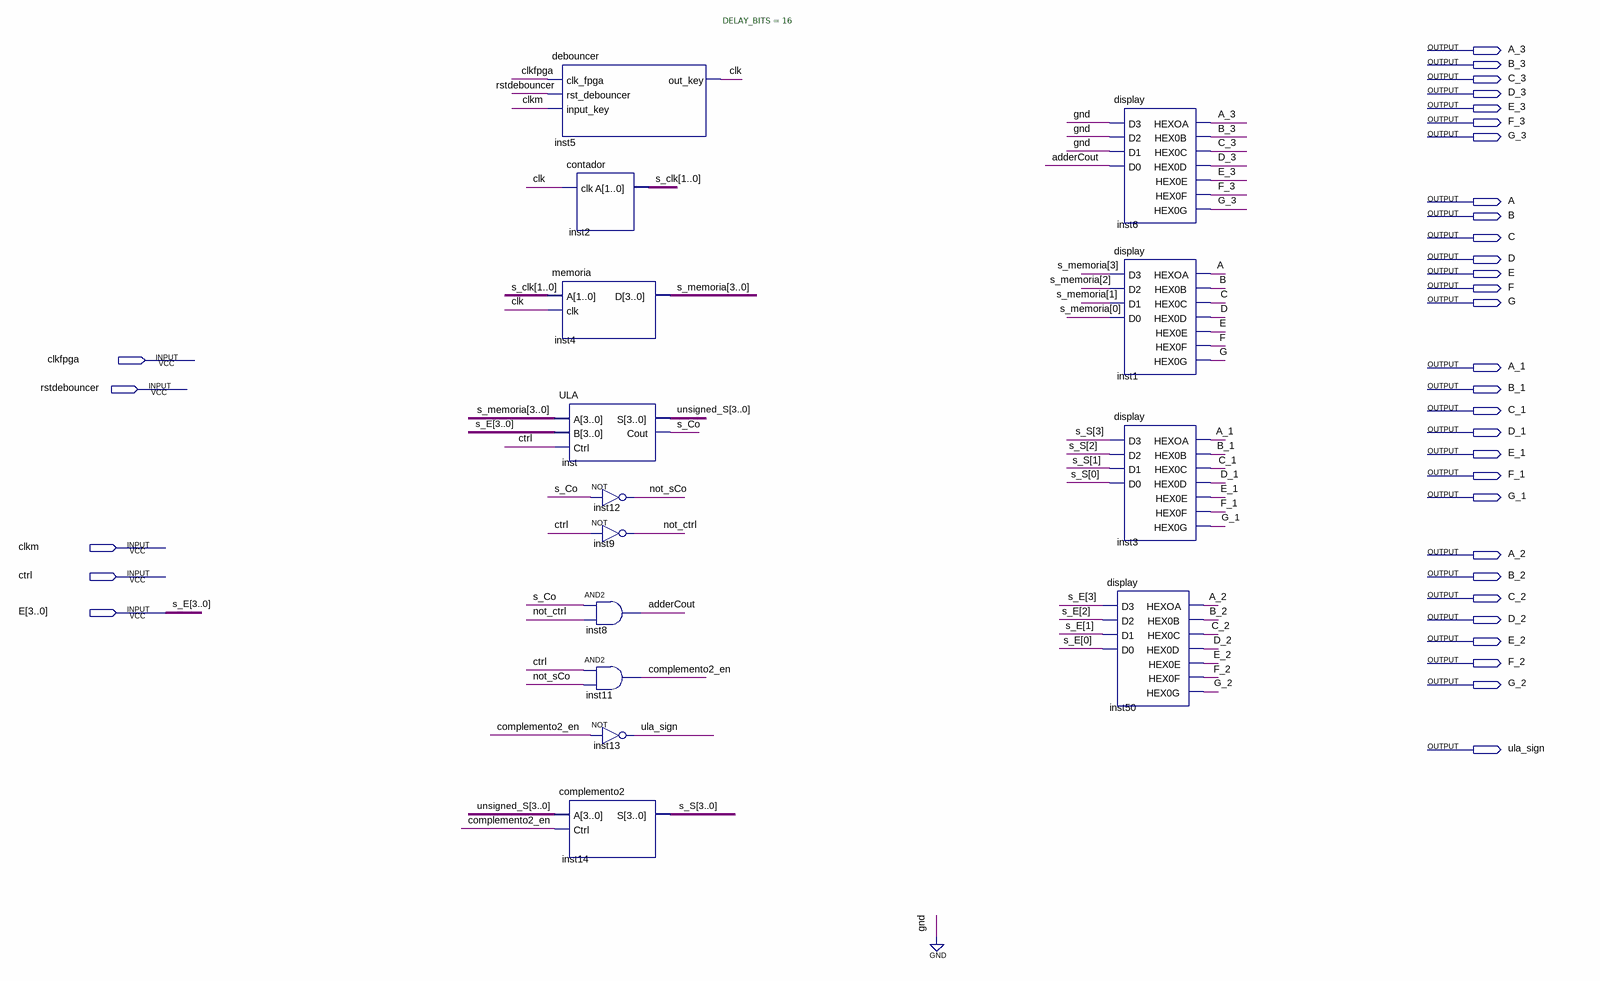
[diagram p0: schematic sheet]
// Quartus schematic calculadora.bdf as structural Verilog: 14 symbols, 34 pins
module calculadora (
  input  clkfpga,
  input  rstdebouncer,
  input  clkm,
  input  ctrl,
  input  [3:0] E,
  output A_3,
  output B_3,
  output C_3,
  output D_3,
  output E_3,
  output F_3,
  output G_3,
  output A,
  output B,
  output C,
  output D,
  output E_1bit,
  output F,
  output G,
  output A_1,
  output B_1,
  output C_1,
  output D_1,
  output E_1,
  output F_1,
  output G_1,
  output A_2,
  output B_2,
  output C_2,
  output D_2,
  output E_2,
  output F_2,
  output G_2,
  output ula_sign
);

  wire adderCout, clk, complemento2_en, not_ctrl, not_sCo, s_Co;
  wire [1:0] s_clk;
  wire [3:0] s_memoria, s_S, unsigned_S;

  debouncer #(.DELAY_BITS(16)) inst5 (
    .clk_fpga(clkfpga), .rst_debouncer(rstdebouncer), .input_key(clkm), .out_key(clk));
  memoria inst4 (.A(s_clk), .clk(clk), .D(s_memoria));
  ULA inst (.A(s_memoria), .B(E), .Ctrl(ctrl), .S(unsigned_S), .Cout(s_Co));
  complemento2 inst14 (.A(unsigned_S), .Ctrl(complemento2_en), .S(s_S));
  contador inst2 (.clk(clk), .A(s_clk));
  not inst12 (not_sCo, s_Co);
  not inst9 (not_ctrl, ctrl);
  and inst8 (adderCout, s_Co, not_ctrl);
  and inst11 (complemento2_en, ctrl, not_sCo);
  not inst13 (ula_sign, complemento2_en);
  display inst6 (
    .D3(1'b0), .D2(1'b0), .D1(1'b0), .D0(adderCout), .HEXOA(A_3), .HEX0B(B_3), .HEX0C(C_3), .HEX0D(D_3),
    .HEX0E(E_3), .HEX0F(F_3), .HEX0G(G_3));
  display inst1 (
    .D3(s_memoria[3]), .D2(s_memoria[2]), .D1(s_memoria[1]), .D0(s_memoria[0]), .HEXOA(A), .HEX0B(B),
    .HEX0C(C), .HEX0D(D), .HEX0E(E_1bit), .HEX0F(F), .HEX0G(G));
  display inst3 (
    .D3(s_S[3]), .D2(s_S[2]), .D1(s_S[1]), .D0(s_S[0]), .HEXOA(A_1), .HEX0B(B_1), .HEX0C(C_1), .HEX0D(D_1),
    .HEX0E(E_1), .HEX0F(F_1), .HEX0G(G_1));
  display inst50 (
    .D3(E[3]), .D2(E[2]), .D1(E[1]), .D0(E[0]), .HEXOA(A_2), .HEX0B(B_2), .HEX0C(C_2), .HEX0D(D_2),
    .HEX0E(E_2), .HEX0F(F_2), .HEX0G(G_2));

  // Other names for the same wires on the sheet: s_E[3:0] = E
endmodule
